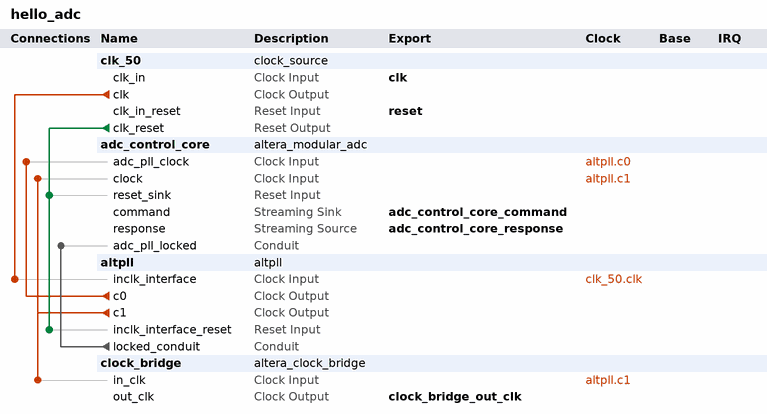
[diagram p0: system contents]
# Platform Designer (Qsys) system hello_adc, MAX 10 10M50DAF484C7G
# Parameters at their usual value, and those the tool derives, are not listed.
package require -exact qsys 21.1
create_system hello_adc
set_project_property DEVICE_FAMILY {MAX 10}
set_project_property DEVICE 10M50DAF484C7G

add_instance clk_50 clock_source 21.1
set_instance_parameter_value clk_50 clockFrequency 50000000

add_instance adc_control_core altera_modular_adc 21.1
set_instance_parameter_value adc_control_core CLOCK_FREQ 50000000
set_instance_parameter_value adc_control_core CORE_VAR 3
set_instance_parameter_value adc_control_core DEVICE_PART 10M50DAF484C7G
set_instance_parameter_value adc_control_core clkdiv 2
set_instance_parameter_value adc_control_core int_vref_vr 3.0
set_instance_parameter_value adc_control_core refsel 0
set_instance_parameter_value adc_control_core sample_rate 0
set_instance_parameter_value adc_control_core seq_order_length 1
set_instance_parameter_value adc_control_core seq_order_slot_1 30
set_instance_parameter_value adc_control_core seq_order_slot_2 30
set_instance_parameter_value adc_control_core seq_order_slot_3 30
set_instance_parameter_value adc_control_core seq_order_slot_4 30
set_instance_parameter_value adc_control_core seq_order_slot_5 30
set_instance_parameter_value adc_control_core seq_order_slot_6 30
set_instance_parameter_value adc_control_core seq_order_slot_7 30
set_instance_parameter_value adc_control_core use_ch0 false
set_instance_parameter_value adc_control_core use_ch2 true
set_instance_parameter_value adc_control_core use_ch3 true
set_instance_parameter_value adc_control_core use_ch4 true
set_instance_parameter_value adc_control_core use_ch5 true
set_instance_parameter_value adc_control_core use_ch6 true
set_instance_parameter_value adc_control_core use_ch7 false
set_instance_parameter_value adc_control_core use_ch8 false
set_instance_parameter_value adc_control_core use_tsd true

add_instance altpll altpll 21.1
set_instance_parameter_value altpll CLK0_DIVIDE_BY 5
set_instance_parameter_value altpll CLK0_MULTIPLY_BY 1
set_instance_parameter_value altpll CLK1_DIVIDE_BY 1
set_instance_parameter_value altpll CLK1_DUTY_CYCLE 50
set_instance_parameter_value altpll CLK1_MULTIPLY_BY 1
set_instance_parameter_value altpll CLK1_PHASE_SHIFT 0
set_instance_parameter_value altpll INCLK0_INPUT_FREQUENCY 20000
set_instance_parameter_value altpll PORT_ARESET PORT_USED
set_instance_parameter_value altpll PORT_LOCKED PORT_USED
set_instance_parameter_value altpll PORT_clk1 PORT_USED
set_instance_parameter_value altpll PORT_clk2 PORT_UNUSED
set_instance_parameter_value altpll PORT_clk3 PORT_UNUSED

add_instance clock_bridge altera_clock_bridge 21.1
set_instance_parameter_value clock_bridge DERIVED_CLOCK_RATE 50000000
set_instance_parameter_value clock_bridge EXPLICIT_CLOCK_RATE 0

# connections
add_connection altpll.c0 adc_control_core.adc_pll_clock clock
add_connection altpll.c1 adc_control_core.clock clock
add_connection altpll.c1 clock_bridge.in_clk clock
add_connection clk_50.clk altpll.inclk_interface clock
add_connection clk_50.clk_reset adc_control_core.reset_sink reset
add_connection clk_50.clk_reset altpll.inclk_interface_reset reset
add_connection altpll.locked_conduit adc_control_core.adc_pll_locked conduit

# exported interfaces
add_interface adc_control_core_command avalon_streaming sink
set_interface_property adc_control_core_command EXPORT_OF adc_control_core.command
add_interface adc_control_core_response avalon_streaming source
set_interface_property adc_control_core_response EXPORT_OF adc_control_core.response
add_interface clk clock sink
set_interface_property clk EXPORT_OF clk_50.clk_in
add_interface clock_bridge_out_clk clock source
set_interface_property clock_bridge_out_clk EXPORT_OF clock_bridge.out_clk
add_interface reset reset sink
set_interface_property reset EXPORT_OF clk_50.clk_in_reset

set_interconnect_requirement {$system} qsys_mm.clockCrossingAdapter HANDSHAKE
set_interconnect_requirement {$system} qsys_mm.enableEccProtection FALSE
set_interconnect_requirement {$system} qsys_mm.insertDefaultSlave FALSE
set_interconnect_requirement {$system} qsys_mm.maxAdditionalLatency 1

save_system hello_adc.qsys
